# Altium schematic sheet NIR-Spec-Motherboard-SCH_SH2_(02).SchDoc: SCHEMATIC
size 863 x 558 mm; DocumentNumber: NIR-Spec-2; SheetNumber: 2; SheetTotal: 3; PageSetup: Record=PageOptions|CenterHorizontal=True|CenterVertical=True|PrintScale=0.98|XCorrection=1.00|YCorrection=1.00|PrintKind=2|BorderSize=5000000|LeftOffset=0|BottomOffset=0|Orientation=2|PaperLength=1000|PaperWidth=1000|Scale=100|PaperSource=15|PrintQuality=1200|MediaType=1|DitherType=10|PaperKind=11 x 17|PrintScaleMode=1
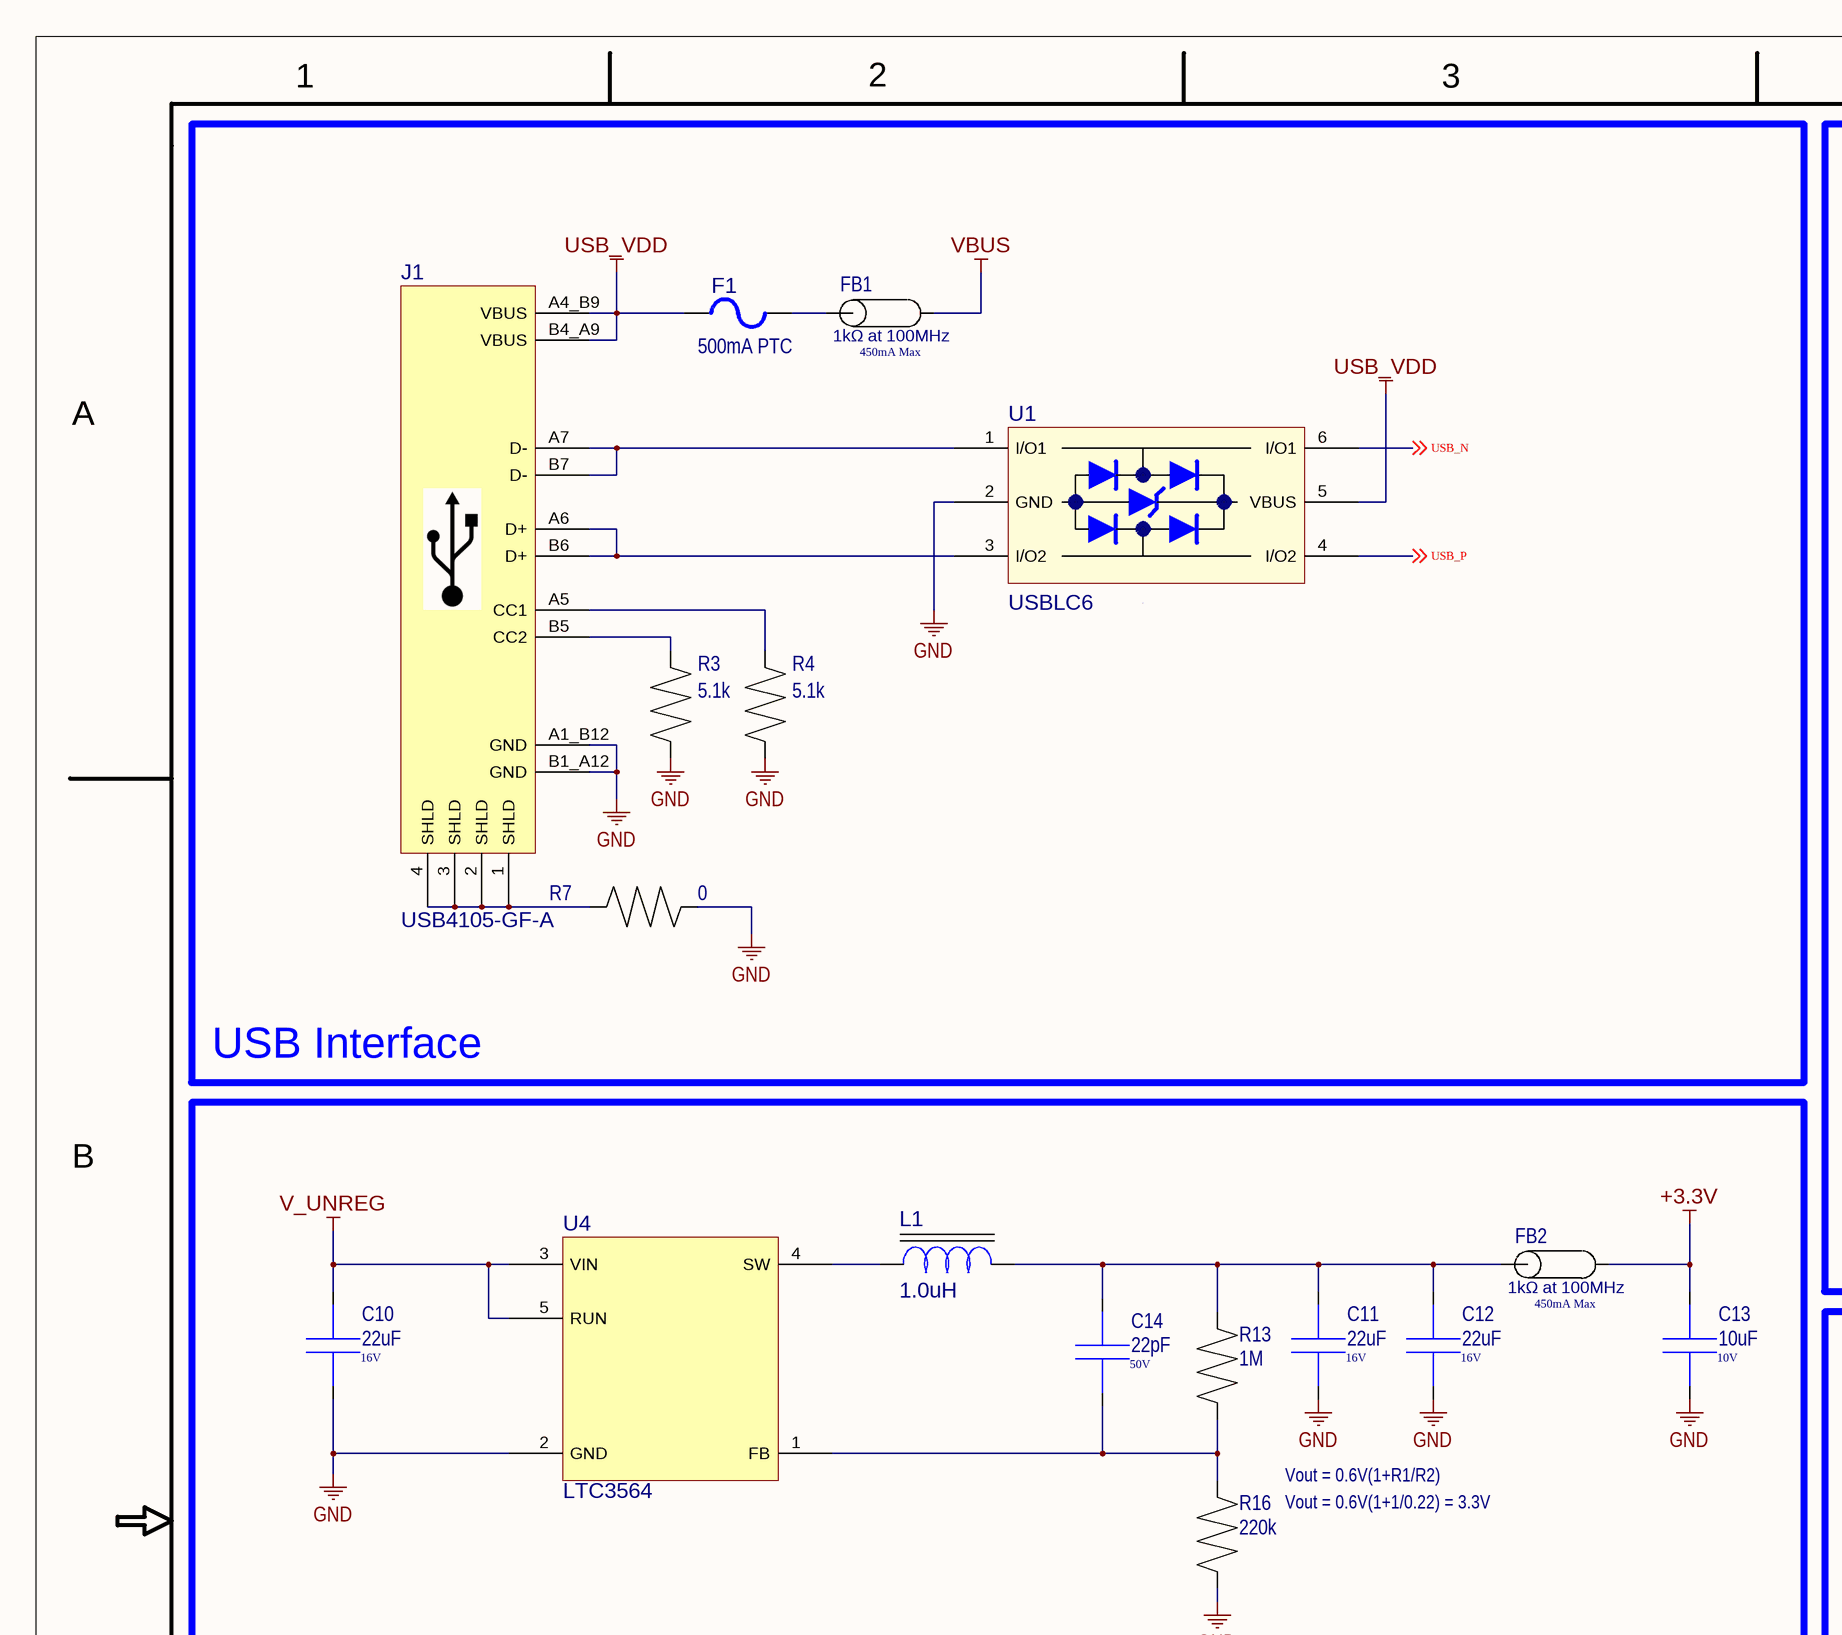
[diagram p0: NIR-Spec-Motherboard-SCH_SH2_(02).SchDoc, top left]
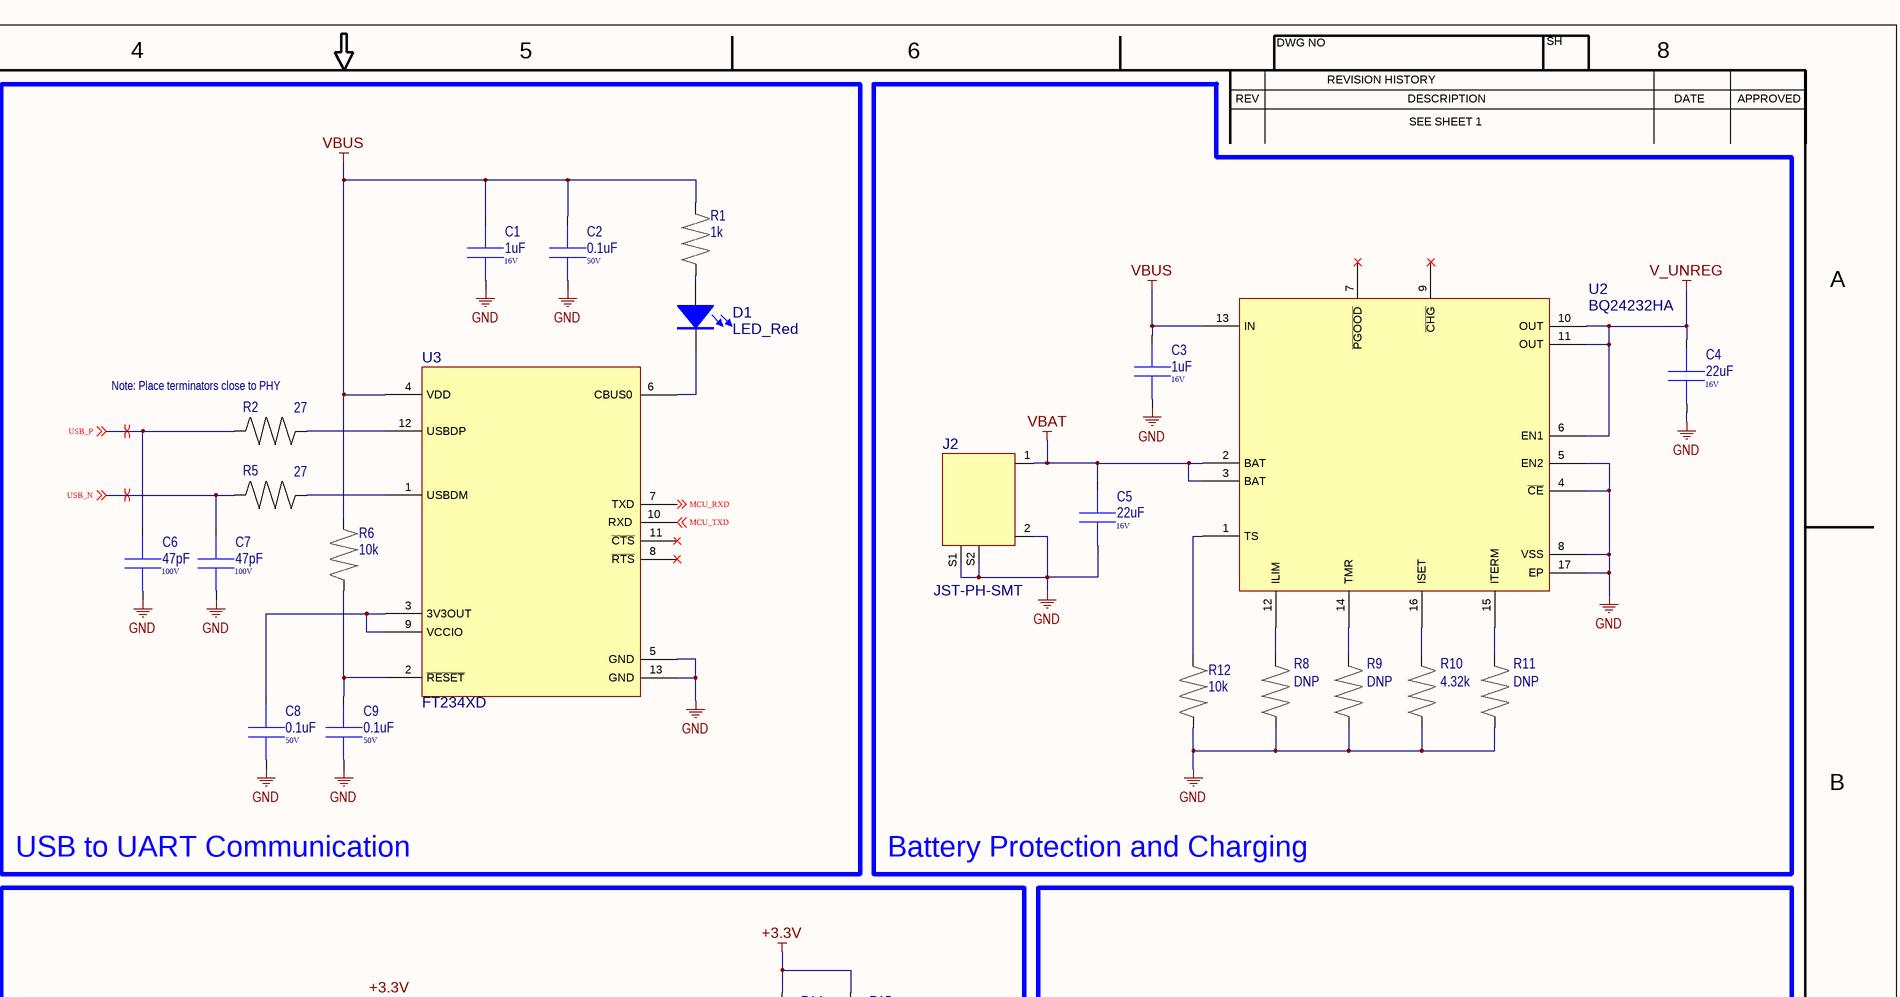
[diagram p1: NIR-Spec-Motherboard-SCH_SH2_(02).SchDoc, top right]
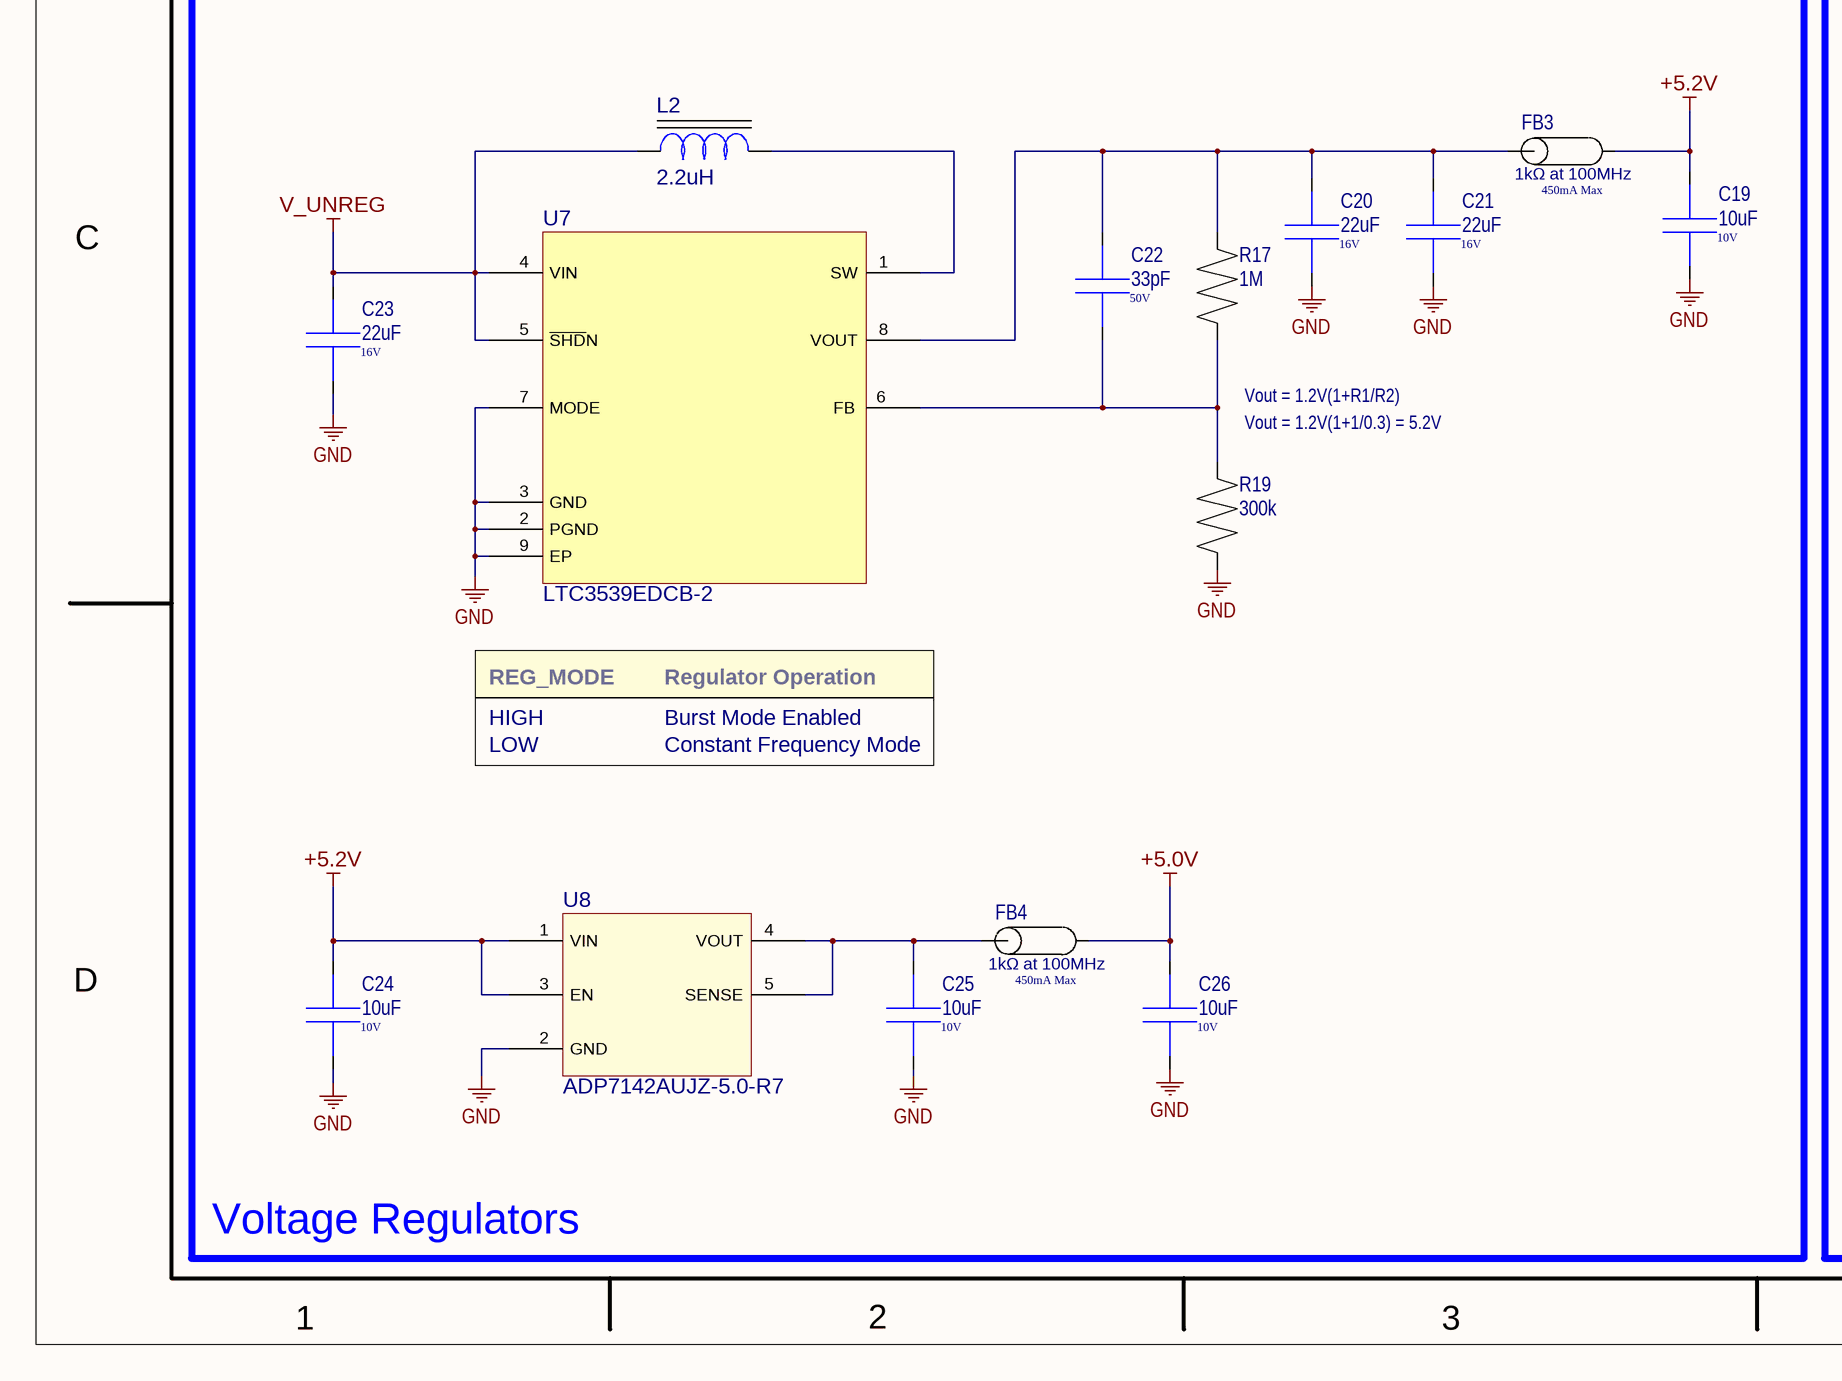
[diagram p2: NIR-Spec-Motherboard-SCH_SH2_(02).SchDoc, bottom left]
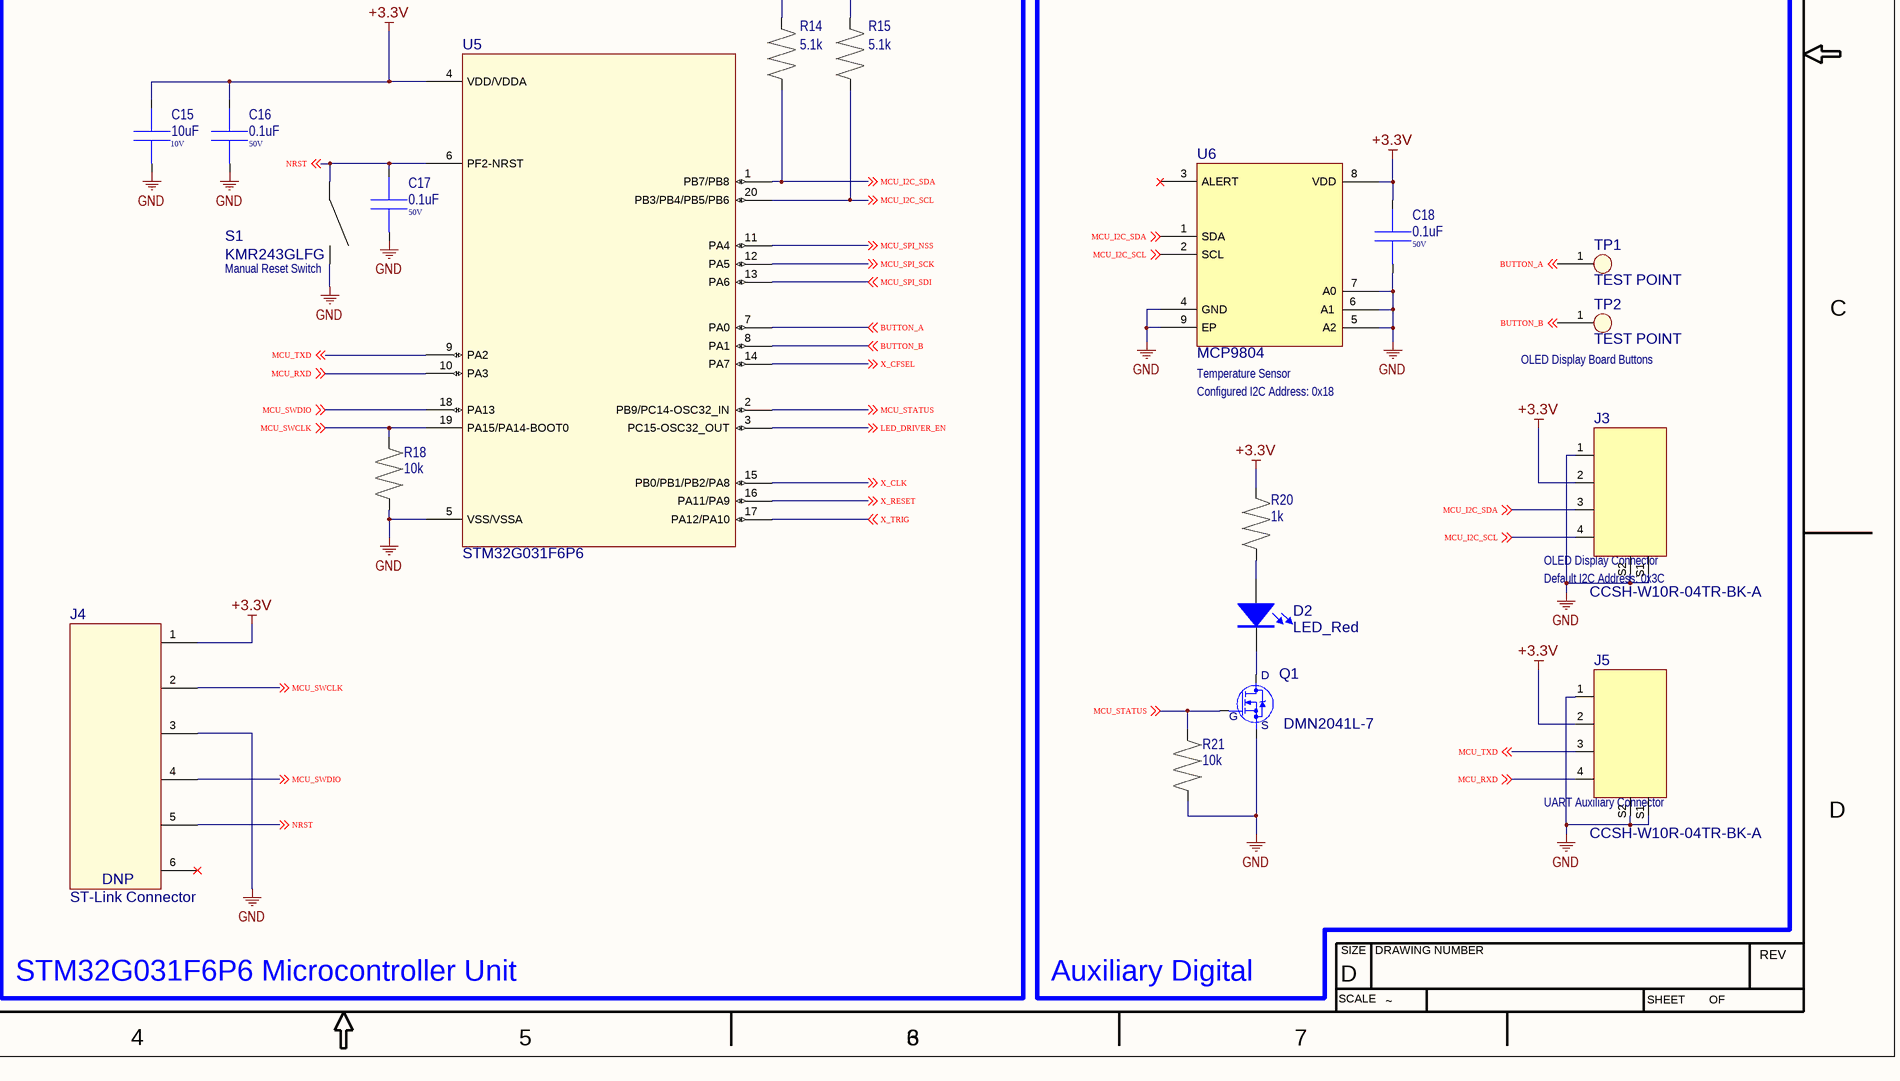
[diagram p3: NIR-Spec-Motherboard-SCH_SH2_(02).SchDoc, bottom right]

## Parts
C1  1uF  Voltage: 16V  [0603]
C2  0.1uF  Voltage: 50V  [0603]
C3  1uF  Voltage: 16V  [0603]
C4  22uF  Voltage: 16V  [0805]
C5  22uF  Voltage: 16V  [0805]
C6  47pF  Voltage: 100V  [0603]
C7  47pF  Voltage: 100V  [0603]
C8  0.1uF  Voltage: 50V  [0603]
C9  0.1uF  Voltage: 50V  [0603]
C10  22uF  Voltage: 16V  [0805]
C11  22uF  Voltage: 16V  [0805]
C12  22uF  Voltage: 16V  [0805]
C13  10uF  Voltage: 10V  [0603]
C14  22pF  Voltage: 50V  [0603]
C15  10uF  Voltage: 10V  [0603]
C16  0.1uF  Voltage: 50V  [0603]
C17  0.1uF  Voltage: 50V  [0603]
C18  0.1uF  Voltage: 50V  [0603]
C19  10uF  Voltage: 10V  [0603]
C20  22uF  Voltage: 16V  [0805]
C21  22uF  Voltage: 16V  [0805]
C22  33pF  Voltage: 50V  [0603]
C23  22uF  Voltage: 16V  [0805]
C24  10uF  Voltage: 10V  [0603]
C25  10uF  Voltage: 10V  [0603]
C26  10uF  Voltage: 10V  [0603]
D1  LED_Red  [0603_LED_Red]
D2  LED_Red  [0603_LED_Red]
F1  500mA PTC  [0603]
FB1  Rated Current: 450mA Max  Impedance: 1kΩ at 100MHz  [0603]  (hidden comment: Ferrite_Bead)
FB2  Rated Current: 450mA Max  Impedance: 1kΩ at 100MHz  [0603]  (hidden comment: Ferrite_Bead)
FB3  Rated Current: 450mA Max  Impedance: 1kΩ at 100MHz  [0603]  (hidden comment: Ferrite_Bead)
FB4  Rated Current: 450mA Max  Impedance: 1kΩ at 100MHz  [0603]  (hidden comment: Ferrite_Bead)
J1  USB4105-GF-A  [USB4105-GF-A]
J2  JST-PH-SMT  [JST-PH-SMT]
J3  CCSH-W10R-04TR-BK-A  [PCBComponent_1]
J4  DNP  [851-43-006-10-001000]
J5  CCSH-W10R-04TR-BK-A  [PCBComponent_1]
L1  1.0uH  [1206]
L2  2.2uH  [1206]
Q1  DMN2041L-7  [SOT-23-3]
R1  1k  [0603]
R2  27  [0603]
R3  5.1k  [0603]
R4  5.1k  [0603]
R5  27  [0603]
R6  10k  [0603]
R7  0  [0603]
R8  DNP  [0603]
R9  DNP  [0603]
R10  4.32k  [0603]
R11  DNP  [0603]
R12  10k  [0603]
R13  1M  [0603]
R14  5.1k  [0603]
R15  5.1k  [0603]
R16  220k  [0603]
R17  1M  [0603]
R18  10k  [0603]
R19  300k  [0603]
R20  1k  [0603]
R21  10k  [0603]
S1  KMR243GLFG  [KMR 2 Series]
TP1  TEST POINT  [30x40 TP]
TP2  TEST POINT  [30x40 TP]
U1  USBLC6  [SOT-23-6_N]
U2  BQ24232HA  [QFN-16]
U3  FT234XD  [DFN-12]
U4  LTC3564  [TSOT-23-5]
U5  STM32G031F6P6  [TSSOP-20]
U6  MCP9804  [DFN-8]
U7  LTC3539EDCB-2  [DFN-8 2x3]
U8  ADP7142AUJZ-5.0-R7  [TSOT-23-5]

## Blocks framed on the sheet
USB Interface: F1 FB1 J1 R3 R4 R7 U1
USB to UART Communication: C1 C2 C6-C9 D1 R1 R2 R5 R6 U3
Battery Protection and Charging: C3-C5 J2 R8-R12 U2
Voltage Regulators: C10-C14 C19-C26 FB2-FB4 L1 L2 R13 R16 R17 R19 U4 U7 U8
STM32G031F6P6 Microcontroller Unit: C15-C17 J4 R14 R15 R18 S1 U5
Auxiliary Digital: C18 D2 J3 J5 Q1 R20 R21 TP1 TP2 U6

## Nets
+3.3V: C13.2 C15.2 C16.2 C18.2 FB2.2 J3.2 J4.1 J5.2 R14.2 R15.2 R20.2 U5.4(VDD/VDDA) U6.8(VDD)
+5.0V: C26.2 FB4.2
+5.2V: C19.2 C24.2 FB3.2 U8.1(VIN) U8.3(EN)
GND: C1.1 C2.1 C3.1 C4.1 C5.1 C6.1 C7.1 C8.1 C9.1 C10.1 C11.1 C12.1 C13.1 C15.1 C16.1 C17.1 C18.1 C19.1 C20.1 C21.1 C23.1 C24.1 C25.1 C26.1 J1.A1_B12(GND) J1.B1_A12(GND) J2.2 J2.S1 J2.S2 J3.1 J3.S1 J3.S2 J4.3 J5.1 J5.S1 J5.S2 Q1.3(S) R3.1 R4.1 R7.1 R8.1 R9.1 R10.1 R11.1 R12.2 R16.2 R18.2 R19.2 R21.2 S1.2 U1.2(GND) U2.4(~{CE}) U2.5(EN2) U2.8(VSS) U2.17(EP) U3.5(GND) U3.13(GND) U4.2(GND) U5.5(VSS/VSSA) U6.4(GND) U6.5(A2) U6.6(A1) U6.7(A0) U6.9(EP) U7.2(PGND) U7.3(GND) U7.7(MODE) U7.9(EP) U8.2(GND)
USB_VDD: F1.1 J1.A4_B9(VBUS) J1.B4_A9(VBUS) U1.5(VBUS)
V_UNREG: C4.2 C10.2 C23.2 L2.1 U2.6(EN1) U2.10(OUT) U2.11(OUT) U4.3(VIN) U4.5(RUN) U7.4(VIN) U7.5(~{SHD}N)
VBAT: C5.2 J2.1 U2.2(BAT) U2.3(BAT)
VBUS: C1.2 C2.2 C3.2 FB1.2 R1.2 R6.1 U2.13(IN) U3.4(VDD)
BUTTON_A: TP1.1 U5.7(PA0) ; off-sheet BUTTON_A
BUTTON_B: TP2.1 U5.8(PA1) ; off-sheet BUTTON_B
LED_DRIVER_EN: U5.3(PC15-OSC32_OUT) ; off-sheet LED_DRIVER_EN
MCU_I2C_SCL: J3.4 R15.1 U5.20(PB3/PB4/PB5/PB6) U6.2(SCL) ; off-sheet MCU_I2C_SCL
MCU_I2C_SDA: J3.3 R14.1 U5.1(PB7/PB8) U6.1(SDA) ; off-sheet MCU_I2C_SDA
MCU_RXD: J5.4 U3.7(TXD) U5.10(PA3) ; off-sheet MCU_RXD
MCU_SPI_NSS: U5.11(PA4) ; off-sheet MCU_SPI_NSS
MCU_SPI_SCK: U5.12(PA5) ; off-sheet MCU_SPI_SCK
MCU_SPI_SDI: U5.13(PA6) ; off-sheet MCU_SPI_SDI
MCU_STATUS: Q1.1(G) R21.1 U5.2(PB9/PC14-OSC32_IN) ; off-sheet MCU_STATUS
MCU_SWCLK: J4.2 R18.1 U5.19(PA15/PA14-BOOT0) ; off-sheet MCU_SWCLK
MCU_SWDIO: J4.4 U5.18(PA13) ; off-sheet MCU_SWDIO
MCU_TXD: J5.3 U3.10(RXD) U5.9(PA2) ; off-sheet MCU_TXD
NRST: C17.2 J4.5 S1.1 U5.6(PF2-NRST) ; off-sheet NRST
USB_N: C7.2 R5.1 U1.6(I/O1) ; off-sheet USB_N
USB_P: C6.2 R2.1 U1.4(I/O2) ; off-sheet USB_P
X_CFSEL: U5.14(PA7) ; off-sheet X_CFSEL
X_CLK: U5.15(PB0/PB1/PB2/PA8) ; off-sheet X_CLK
X_RESET: U5.16(PA11/PA9) ; off-sheet X_RESET
X_TRIG: U5.17(PA12/PA10) ; off-sheet X_TRIG
NetC8_2: C8.2 U3.3(3V3OUT) U3.9(VCCIO)
NetC9_2: C9.2 R6.2 U3.2(~{RESET})
NetC11_2: C11.2 C12.2 C14.2 FB2.1 L1.2 R13.1
NetC14_1: C14.1 R13.2 R16.1 U4.1(FB)
NetC20_2: C20.2 C21.2 C22.2 FB3.1 R17.1 U7.8(VOUT)
NetC22_1: C22.1 R17.2 R19.1 U7.6(FB)
NetC25_2: C25.2 FB4.1 U8.4(VOUT) U8.5(SENSE)
NetD1_1: D1.1(A) R1.1
NetD1_2: D1.2(K) U3.6(CBUS0)
NetD2_1: D2.1(A) R20.1
NetD2_2: D2.2(K) Q1.2(D)
NetF1_2: F1.2 FB1.1
NetJ1_1: J1.1(SHLD) J1.2(SHLD) J1.3(SHLD) J1.4(SHLD) R7.2
NetJ1_A5: J1.A5(CC1) R4.2
NetJ1_A6: J1.A6(D+) J1.B6(D+) U1.3(I/O2)
NetJ1_A7: J1.A7(D-) J1.B7(D-) U1.1(I/O1)
NetJ1_B5: J1.B5(CC2) R3.2
NetL1_1: L1.1 U4.4(SW)
NetL2_2: L2.2 U7.1(SW)
NetR2_2: R2.2 U3.12(USBDP)
NetR5_2: R5.2 U3.1(USBDM)
NetR8_2: R8.2 U2.12(ILIM)
NetR9_2: R9.2 U2.14(TMR)
NetR10_2: R10.2 U2.16(ISET)
NetR11_2: R11.2 U2.15(ITERM)
NetR12_1: R12.1 U2.1(TS)

Not connected (* = marked no-connect by the designer): J4 6*; U2 7(~{PGOOD})* 9(~{CHG})*; U3 8(~{RTS})* 11(~{CTS})*; U6 3(ALERT)*

## Layout directives
differential pair: USB_N, USB_P

## Notes on the sheet
- 1
- 2
- 3
- 4
- 5
- 6
- DWG NO
- REVISION HISTORY
- SH
- 8
- REV
- DESCRIPTION
- SEE SHEET 1
- DATE
- APPROVED
- A
- Note: Place terminators close to PHY
- B
- Vout = 0.6V(1+1/0.22) = 3.3V
- Vout = 0.6V(1+R1/R2)
- (near S1) Manual Reset Switch
- C
- Temperature Sensor
- (near TP2) OLED Display Board Buttons
- (near R19) Vout = 1.2V(1+1/0.3) = 5.2V
- Vout = 1.2V(1+R1/R2)
- Configured I2C Address: 0x18
- OLED Display Connector
- REG_MODE
- Regulator Operation
- Default I2C Address: 0x3C
- HIGH
- LOW
- Burst Mode Enabled
- Constant Frequency Mode
- D
- UART Auxiliary Connector
- (near J4) ST-Link Connector
- SIZE
- DRAWING NUMBER
- SCALE
- ~
- SHEET        OF
- 7

## Library data of the parts
C1 C3 = CAP: CAP CER 1UF 10V X5R 0603; Part Number: GRM188R61C105KA12J; Manufacturer: Murata Electronics
  C1: ClassName: USB to UART PHY
  C3: ClassName: Power Path
C2 C8 C9 C16-C18 = CAP: CAP CER 0.1UF 50V X7R 0603; Part Number: C0603C104K5RAC3121; Manufacturer: KEMET
  C2 C8 C9: ClassName: USB to UART PHY
  C16 C17: ClassName: STM32 MCU
  C18: ClassName: Aux Digital
C4 C5 C10-C12 C20 C21 C23 = CAP: CAP CER 22UF 16V X5R 0805; Part Number: CL21A226MOCLRNC; Manufacturer: Samsung Electro-Mechanics
  C4 C5: ClassName: Power Path
  C10-C12: ClassName: 3.3V Regulator
  C20 C21 C23: ClassName: 6.0V Regulator
C6 C7 = CAP: CAP CER 10PF 50V NP0 0603; Part Number: 06031A470KAT2A; Manufacturer: Kyocera AVX; ClassName: USB to UART PHY
C13 C15 C19 C24-C26 = CAP: CAP CER 10UF 10V X6S 0603; Part Number: GRM188C81A106MA73D; Manufacturer: Murata Electronics
  C13: ClassName: 3.3V Regulator
  C15: ClassName: STM32 MCU
  C19: ClassName: 6.0V Regulator
  C24-C26: ClassName: 5.0V Regulator
C14 = CAP: CAP CER 22PF NP0 50V 0603; Part Number: VJ0603A220KXAAC; Manufacturer: Vishay; ClassName: 3.3V Regulator
C22 = CAP: CAP CER 33PF 50V NP0 0603; Part Number: 06035A330J4T4A; Manufacturer: Kyocera AVX; ClassName: 6.0V Regulator
D1 D2 = LED_Red: Standard LEDs - SMD HE Red 645 nm Water Clear; Part Number: SM0603HCL; Manufacturer: Bivar
  D1: ClassName: USB to UART PHY
  D2: ClassName: Aux Digital
F1 = FUSE: 500mA PTC Fuse; Part Number: MF-FSMF050X-2; Manufacturer: Bourns; ClassName: USB Interface
FB1-FB4 = Ferrite_Bead: Ferrite Beads 1000 OHM 25%; Manufacturer: Murata Electronics; Part Number: BLM18AG102SH1D
  FB1: ClassName: USB Interface
  FB2: ClassName: 3.3V Regulator
  FB3: ClassName: 6.0V Regulator
  FB4: ClassName: 5.0V Regulator
J1 = USB4105-GF-A: USB-C (USB TYPE-C) USB 2.0 Receptacle Connector 24 (16+8 Dummy) Position Surface Mount, Right Angle; Through Hole; Manufacturer: GCT; Part Number: USB4105-GF-A; ClassName: USB Interface
J3 J5 = CCSH-W10R-04TR-BK-A: Manufacturer: JST; Part Number: CCSH-W10R-04TR-BK-A; ClassName: Aux Digital
J4 = 851-43-006-10-001000: CONN, RECPT, 6 POS, 0.050" (1.27MM) GOLD TH; Manufacturer: Mill-max; Part Number: 851-43-006-10-001000; ClassName: STM32 MCU
L1 = SHIELDED_INDUCTOR: Part Number: MLP2016S1R0MT0S1; Manufacturer: TDK; ClassName: 3.3V Regulator
L2 = SHIELDED_INDUCTOR: Part Number: MLP2016H2R2MT0S1; Manufacturer: TDK; ClassName: 6.0V Regulator
Q1 = MOSFET_N: MOSFET, N CH, 3-PIN; Manufacturer: Diodes Incorporated; Part Number: DMN2041L-7; ClassName: Aux Digital
R1 R20 = RES: Thin Film Resistors - SMD CPF A 0603 1K0 0.1% 25PPM; Part Number: CPF-A-0603B1K0E; Manufacturer: TE Connectivity
  R1: ClassName: USB to UART PHY
  R20: ClassName: Aux Digital
R2 R5 = RES: Thin Film Resistors - SMD 0603 27ohms 50ppm 0.5%; Part Number: ERA-3AHD270V; Manufacturer: Panasonic; ClassName: USB to UART PHY
R3 R4 R14 R15 = RES: Thick Film Resistors - SMD 0603 5.1Kohm 5% High Voltage; Part Number: KTR03EZPJ512; Manufacturer: ROHM Semiconductor
  R3 R4: ClassName: USB Interface
  R14 R15: ClassName: STM32 MCU
R6 R12 R18 R21 = RES: Thick Film Resistors - SMD 1/5W 10Kohms 1% 100ppm; Part Number: RCC060310K0FKEA; Manufacturer: Vishay
  R6: ClassName: USB to UART PHY
  R12: ClassName: Power Path
  R18: ClassName: STM32 MCU
  R21: ClassName: Aux Digital
R7 = RES: SMD 0.33W Zero ohm Jumper High Power; Part Number: CRCW06030000Z0EAHP; Manufacturer: Vishay; ClassName: USB Interface
R8 R9 R11 = RES: RESISTOR; Part Number: *; Manufacturer: *; ClassName: Power Path
R10 = RES: Thick Film Resistors - SMD 4.32K ohm 1%; Part Number: CR0603-FX-4321ELF; Manufacturer: Bourns; ClassName: Power Path
R13 R17 = RES: Thick Film Resistors - SMD 1M 1% 1/10W; Part Number: CR0603-FX-1004ELF; Manufacturer: Bourns
  R13: ClassName: 3.3V Regulator
  R17: ClassName: 6.0V Regulator
R16 = RES: Thick Film Resistors - SMD 0603 220Kohm 1% Anti Surge AEC-Q200; Part Number: SDR03EZPF2203; Manufacturer: ROHM Semiconductor; ClassName: 3.3V Regulator
R19 = RES: Thick Film Resistors - SMD 0603 249Kohms 0.2W 1% AEC-Q200; Part Number: ERJ-P03F2493V; Manufacturer: Panasonic; ClassName: 6.0V Regulator
S1 = KMR 2 Series: Tactile Switch SPST-NO Top Actuated Surface Mount; Manufacturer: C&K; Part Number: KMR243GFLG; ClassName: STM32 MCU
U1 = USBLC6-2SC6: IC ESD PROTECTION LO CAP SOT23-6; Manufacturer: STMicroelectronics; Part Number: USBLC6-2SC6; ClassName: USB Interface
U2 = BQ24232HA: IC BATT CHG LI-ION 1CELL 16QFN; Manufacturer: Texas Instruments; Part Number: BQ24232HA; ClassName: Power Path
U3 = FT234XD: IC USB SERIAL BASIC UART 12DFN; Part Number: FT234XD-R; Manufacturer: FTDI; ClassName: USB to UART PHY
U4 = LTC3564: IC REG BUCK ADJ 1.25A TSOT23-5; Manufacturer: Linear Technology; Part Number: LTC3564ES5; ClassName: 3.3V Regulator
U5 = STM32G031F6P6: IC MCU 32BIT 32KB FLASH 20TSSOP; Manufacturer: STMicroelectronics; Part Number: STM32G031F6P6; ClassName: STM32 MCU
U6 = MCP9804: SENSOR DIGITAL -40C-125C 8DFN; Manufacturer: Microchip Technology; Part Number: MCP9804T-E/MC; ClassName: Aux Digital
U7 = LTC3539: IC REG BOOST ADJUSTABLE 2A 8DFN; Part Number: LTC3539EDCB-2#TRMPBF; Manufacturer: Analog Devices Inc.; ClassName: 6.0V Regulator
U8 = ADP7142AUJZ-3.3-R7: Manufacturer: Analog Devices; ClassName: 5.0V Regulator; Part Number: ADP7142AUJZ-5.0-R7
J2 = JST-PH-SMT: ClassName: Power Path
TP1 TP2 = TEST POINT: ClassName: Aux Digital